# EAGLE design 2Wireless (EAGLE 7.4.0)
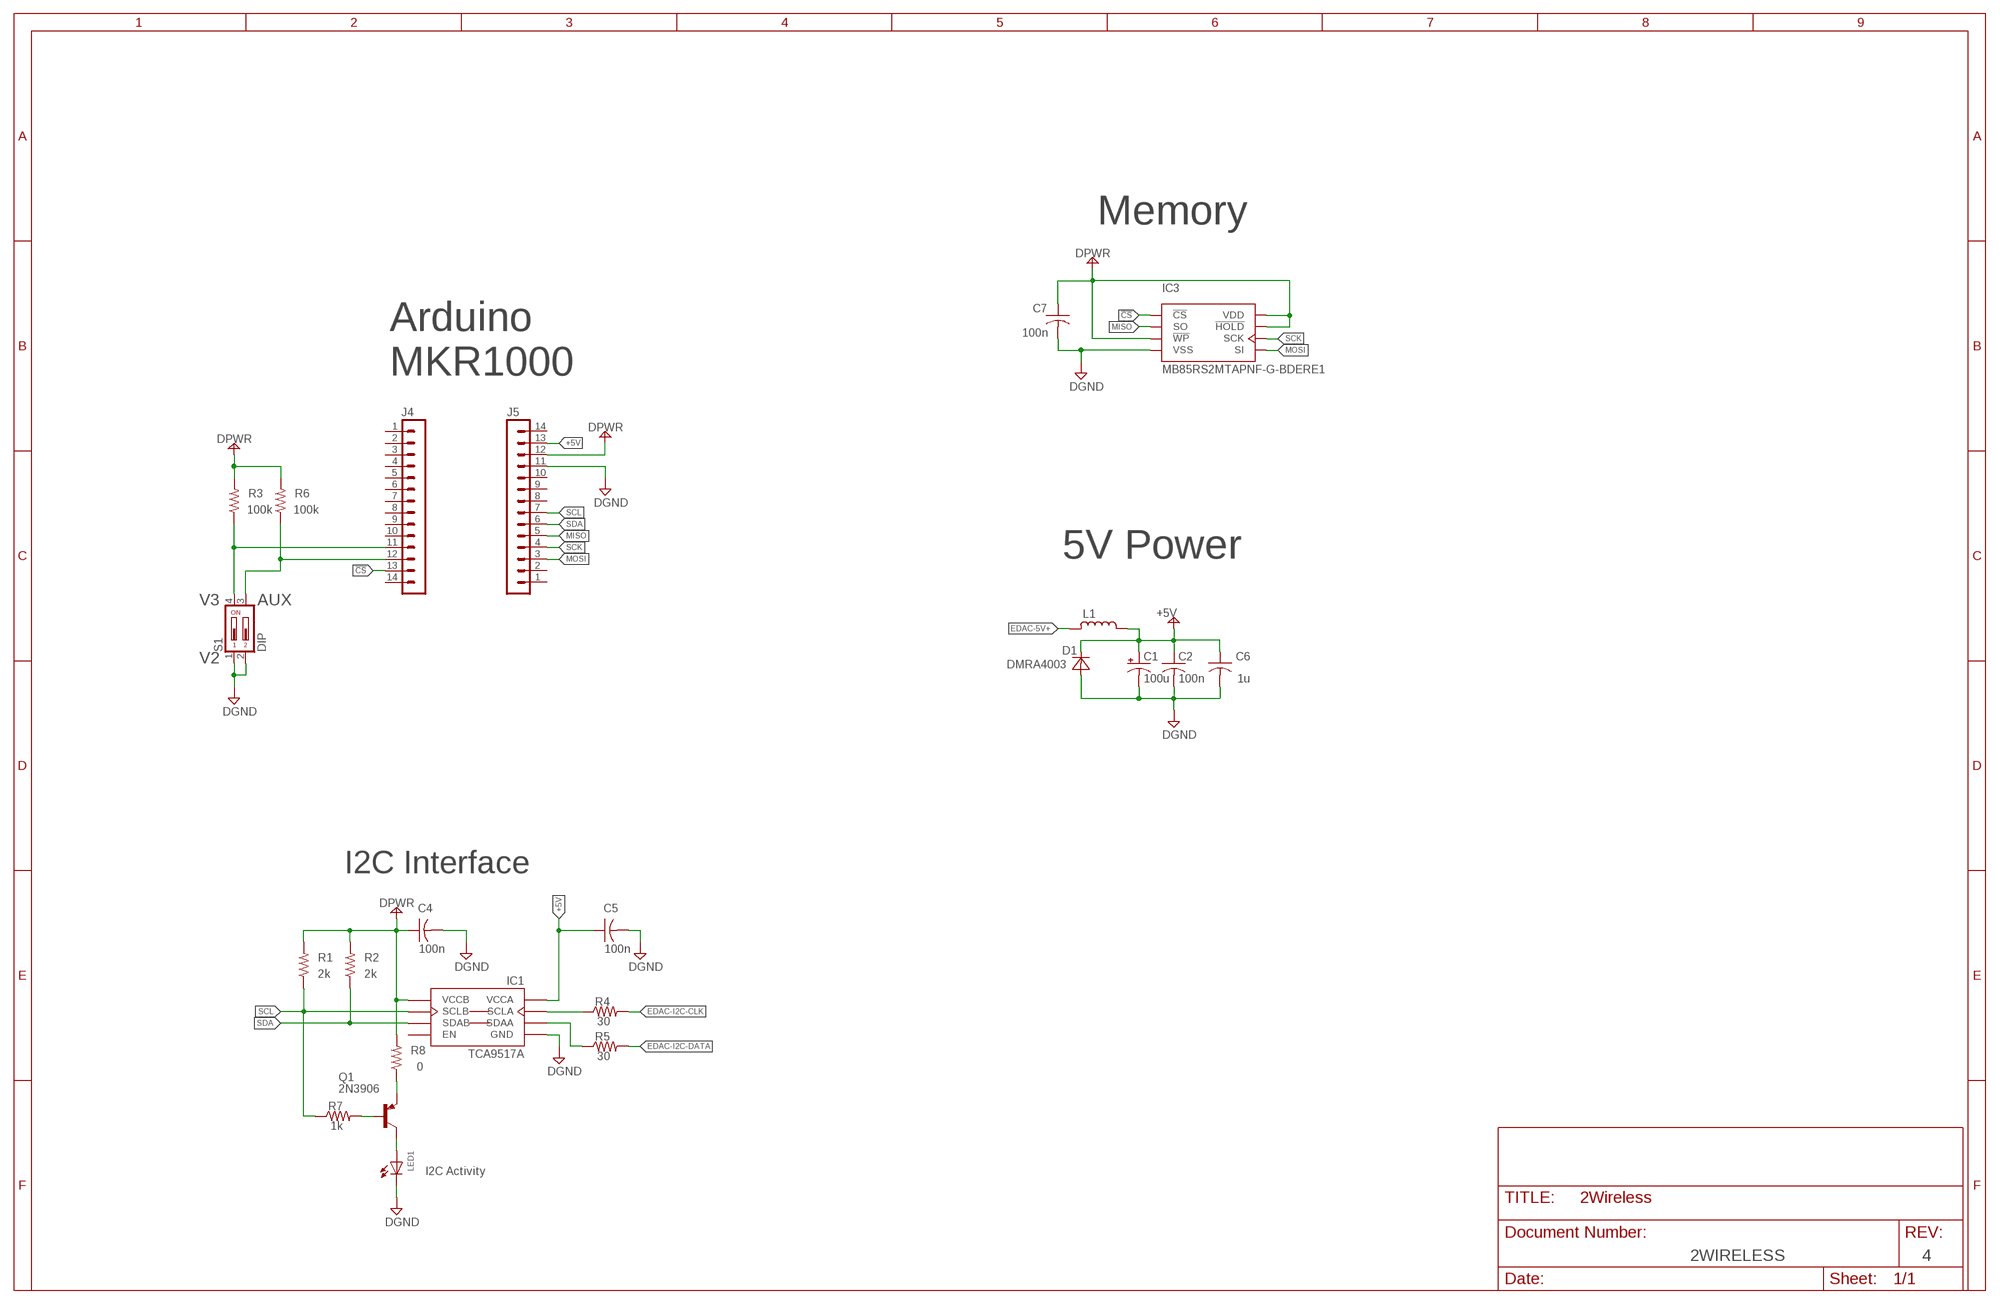
[diagram p0: schematic, sheet 1]

## Parts
C1  100u  C-POLPD  [PAN-D]
C2  100n  CB  [C0603]
C4  100n  CB  [C0603]
C5  100n  CB  [C0603]
C6  1u  CB  [C0603]
C7  100n  CB  [C0603]
D1  DMRA4003  [SMA]
IC1  TCA9517A  I2C-ISOLATORTCA9517A  [MSOP8]
IC3  MB85RS2MTAPNF-G-BDERE1  FRAMSPI  [SO08]
J4  MA14-1  [MA14-1]
J5  MA14-1  [MA14-1]
L1  LB  [0603]
LED1  LED0805BLUE  [CHIPLED_0805]
Q1  2N3906  PNPMMBT3906  [SOT23]
R1  2k  RB  [R0603]
R2  2k  RB  [R0603]
R3  100k  RB  [R0603]
R4  30  RB  [R0603]
R5  30  RB  [R0603]
R6  100k  RB  [R0603]
R7  1k  RB  [R0603]
R8  0  RB  [R0603]
S1  DIP  219-02  [CTS-219-02]

## Nets
!CS: IC3.1(!CS) J4.13
+5V [Power]: C1.+ C2.1 C5.1 C6.1 D1.K(C) IC1.1(VCCA) J5.13 L1.2
DGND: C1.- C2.2 C4.2 C5.2 C6.2 C7.2 D1.A IC1.4(GND) IC3.4(VSS) J5.11 LED1.C S1.1 S1.2
DI-AUX: J4.12 R6.1 S1.3
DI-VERSION: J4.11 R3.1 S1.4
DPWR: C4.1 C7.1 IC1.8(VCCB) IC3.3(!WP) IC3.7(!HOLD) IC3.8(VDD) J5.12 R1.2 R2.2 R3.2 R6.2 R8.2
EDAC-5V+: L1.1
EDAC-I2C-CLK: R4.2
EDAC-I2C-DATA: R5.2
MISO: IC3.2(SO) J5.5
MOSI: IC3.5(SI) J5.3
N$1: Q1.1(B) R7.2
N$2: LED1.A Q1.2(C)
N$3: Q1.3(E) R8.1
N$137: IC1.2(SCLA) R4.1
N$138: IC1.3(SDAA) R5.1
SCK: IC3.6(SCK) J5.4
SCL: IC1.7(SCLB) J5.7 R1.1 R7.1
SDA: IC1.6(SDAB) J5.6 R2.1
Unconnected: IC1.5(EN) J4.1 J4.2 J4.3 J4.4 J4.5 J4.6 J4.7 J4.8 J4.9 J4.10 J4.14 J5.1 J5.2 J5.8 J5.9 J5.10 J5.14

## Notes on the sheet
- Memory
- Arduino
  MKR1000
- 5V Power
- V3 | AUX
- V2
- I2C Interface
- I2C Activity
- 2WIRELESS | 4

## Library data of the parts
C1 = studio_h:C-POL: Polarized Capacitor; MF: PANASONIC; MPN: EEE-1CA101WP; Z_DIGIKEY: PCE3880CT-ND; Z_MOUSER: 667-EEE-1CA101WP; Z_SMT: Y
C2 C4-C7 = studio_h:C: Non-Polarized Capacitor; Z_SMT: Y
D1 = studio_h:D: Diode; MF: ON; MPN: MRA4003T3G; Z_DIGIKEY: MRA4003T3GOSCT-ND; Z_MOUSER: 863-MRA4003T3G; Z_SMT: Y
IC1 = studio_h:I2C-ISOLATOR: I2C ISOLATOR Technical Specifications: 2-Bit Bidirectional Isolator for Lines in Mixed-Mode I2C Applications No internal pullups Input glitch filtering Output slope control Shared ground Source: Data Sheet <http://www.ti.com/lit/ds/symlink/tca9517a.pdf>; MF: TI; MPN: TCA9517ADGKR; Z_DIGIKEY: 296-39220-1-ND; Z_MOUSER: 595-TCA9517ADGKR; Z_SMT: Y
IC3 = studio_h:FRAMSPI: FRAM 8SOP Technical Specifications: FRAM Memory SPI Interface Source: Data Sheet <https://www.fujitsu.com/uk/Images/MB85RS2MTA.pdf>; MF: FUJITSU; MPN: MB85RS2MTAPNF-G-BDERE1; Z_DIGIKEY: 865-1286-1-ND; Z_SMT: Y
J4 J5 = studio_h:MA14-1
L1 = studio_h:L: Inductor; MF: WURTH; MPN: 742792609; Z_DIGIKEY: 732-1591-1-ND; Z_MOUSER: 710-742792609; Z_SMT: Y
LED1 = studio_h:LED: LED
Q1 = studio_h:PNP: PNP Transistor; MF: FAIRCHILD; MPN: MMBT3906; Z_DIGIKEY: MMBT3906FSCT-ND; Z_MOUSER: 512-MMBT3906; Z_SMT: Y
R1-R8 = studio_h:R: Resistor; Z_SMT: Y
S1 = studio_h:219-02*: Surface Mount DIP Switch Series 219 SMT CTS Electronic Components Source: www.ctscorp.com; MF: CTS; MPN: 219-2MST; Z_DIGIKEY: CT2192MST-ND; Z_MOUSER: 774-2192MST; Z_SMT: Y

## Net classes
0 Signal: width 0.254 mm, clearance 0.205 mm
1 Power: width 0.508 mm, clearance 0.205 mm to class 0, clearance 0.205 mm
2 GND: width 0.889 mm

## Board
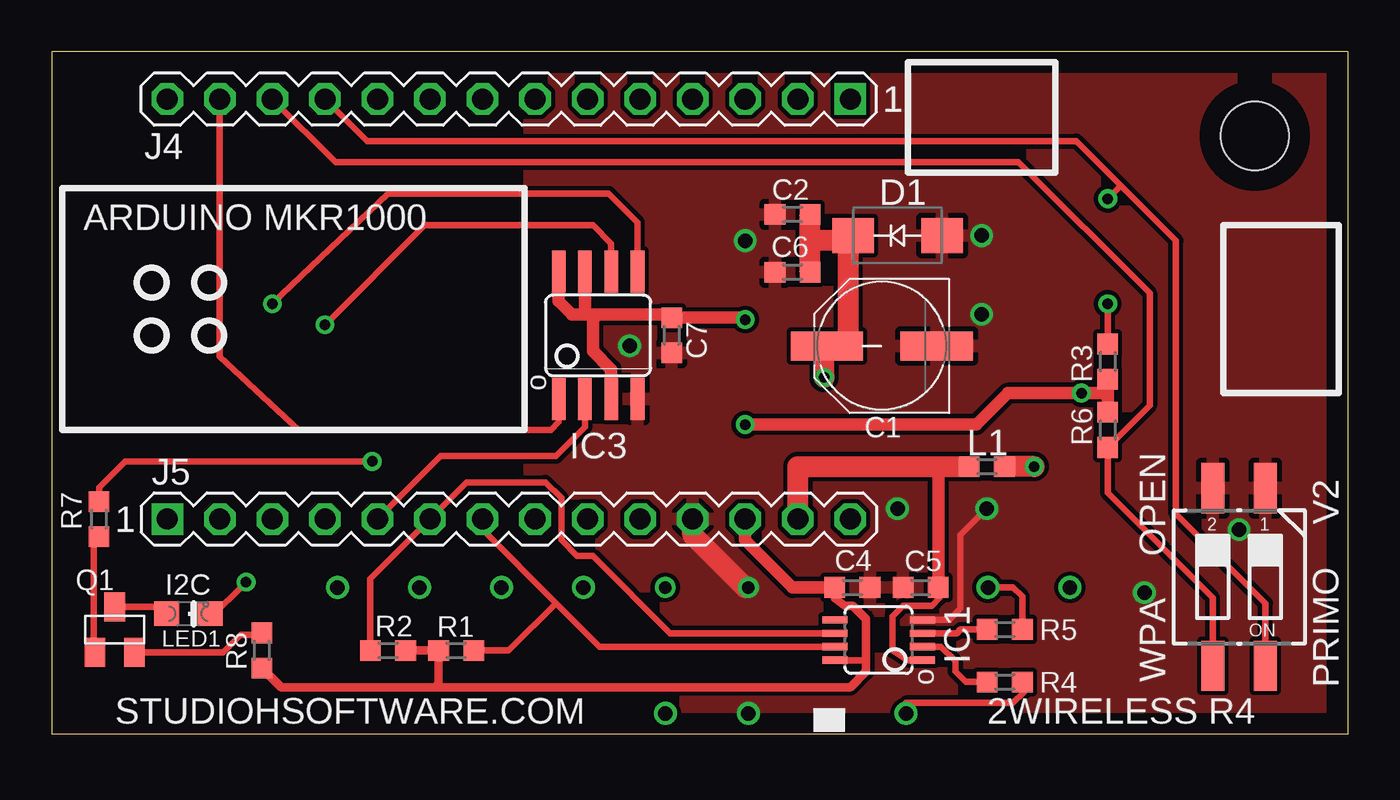
[diagram p1: board, top side]
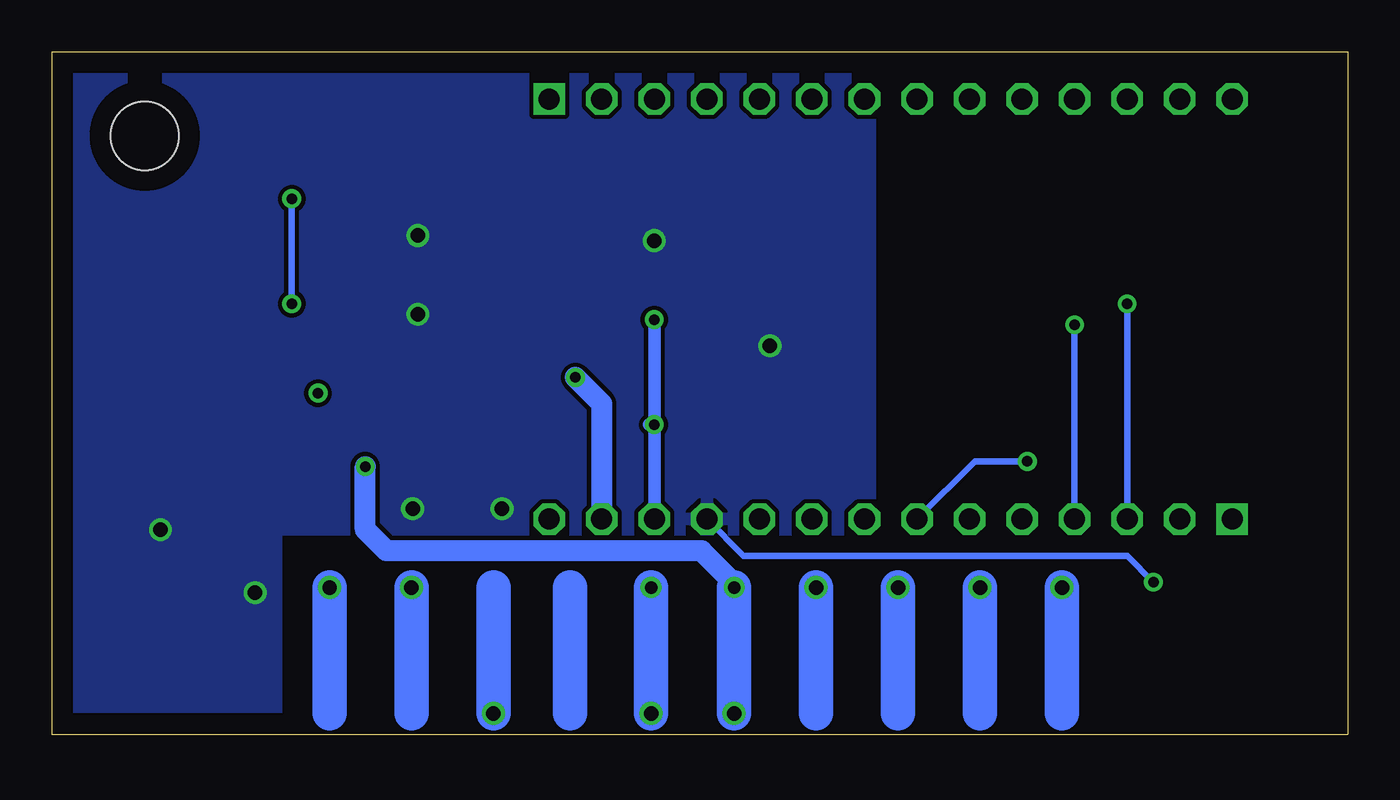
[diagram p2: board, bottom side, seen from below]

Size 62.66 x 33.02 mm. Coordinates in mm from the lower left corner, seen from the top.
Outline: 62.66,33.02 0,33.02 0,0 62.66,0 62.66,33.02
Copper layers (1*16): Top 0.035mm / dielectric 0.2mm / Bottom 0.035mm
Design rules "default *": minimum track width 10mil, minimum drill 20mil, track to track 8mil, track to pad 8mil, pad to pad 8mil, via to via 8mil, smd to smd 8mil, copper to edge 40mil, drill to drill 8mil, minimum pad ring 10mil, minimum via ring 8mil, stop-mask expansion 4mil, vias tented up to drill 0mil, thermal gap 10mil
Holes 3.3 mm at 58.17,28.96

### Footprints (pad centres in the part's own frame; a part is rotated, then mirrored left to right if it is on the bottom)
PAN-D = smd 3.5 x 1.4: + 2.65,0; - -2.65,0
C0603 = smd 1 x 1: 1 -0.85,0; 2 0.85,0
SMA = smd 2 x 1.7: A -2.15,0; K 2.15,0
MSOP8 = smd 0.35 x 1.2: 1 -0.976,-2.113; 2 -0.326,-2.113; 3 0.324,-2.113; 4 0.974,-2.113; 5 0.974,2.112; 6 0.324,2.112; 7 -0.326,2.112; 8 -0.976,2.112
SO08 = smd 0.66 x 2.032: 1 -1.905,-3.073; 2 -0.635,-3.073; 3 0.635,-3.073; 4 1.905,-3.073; 5 1.905,3.073; 6 0.635,3.073; 7 -0.635,3.073; 8 -1.905,3.073
MA14-1 = drill 1.016 square: 1 0,0 | drill 1.016 octagon: 2 2.54,0; 3 5.08,0; 4 7.62,0; 5 10.16,0; 6 12.7,0; 7 15.24,0; 8 17.78,0; 9 20.32,0; 10 22.86,0; 11 25.4,0; 12 27.94,0; 13 30.48,0; 14 33.02,0
0603 = smd 1 x 1: 1 -0.85,0; 2 0.85,0
CHIPLED_0805 = smd 1.2 x 1.2: A 0,-1.05; C 0,1.05
SOT23 = smd 1 x 1.4: 1 -0.95,-1.1; 2 0,1.1; 3 0.95,-1.1
R0603 = smd 1 x 1: 1 -0.85,0; 2 0.85,0
CTS-219-02 = smd 1.13 x 2.44: 1 -1.27,-4.3; 2 1.27,-4.3; 3 1.27,4.3; 4 -1.27,4.3

### Placement (x,y rotation side)
C1  40.13,18.8 180 top
C2  35.81,25.15 180 top
C4  38.71,7.11 0 top
C5  42.01,7.11 180 top
C6  35.81,22.35 180 top
C7  29.97,19.3 270 top
D1  40.89,24.13 180 top
IC1  39.98,4.57 90 top
IC3  26.42,19.3 0 top
J4  38.61,30.73 180 top
J5  5.59,10.41 0 top
L1  45.21,12.95 180 top
LED1  6.6,5.84 270 top
Q1  3.05,5.08 0 top
R1  19.56,4.06 180 top
R2  16.26,4.06 0 top
R3  51.05,18.03 270 top
R4  46.08,2.54 0 top
R5  46.08,5.08 0 top
R6  51.05,14.73 90 top
R7  2.29,10.41 270 top
R8  10.16,4.06 270 top
S1  57.4,7.62 180 top

### Tracks (layer width: path | path; a pad name or v marks a point on that pad's centre or on a via)
!CS
  Top 0.305: IC3.1 24.51,15.11 24.13,14.73 11.94,14.73 8.13,18.29 J4.13
+5V  (via drill 0.51)
  Top 0.305: IC1.1 41.36,3.6 40.64,4.06 40.64,5.71 41.15,6.22 42.55,6.22 42.93,6.6 42.93,7.05 C5.1
  Top 0.61: 38.49,19.19 38.35,19.05 C1.+ | C5.1 42.86,12.76 42.67,12.95
  Top 1.016: 38.49,23.88 38.49,19.19 | C6.1 36.66,23.88 | 36.66,23.88 C2.1 | 38.49,23.88 36.66,23.88 | 38.49,23.88 D1.K | v37.34,17.27 37.34,18.65 C1.+ | J5.13 36.07,12.95 42.67,12.95 L1.2
  Bottom 1.016: v37.34,17.27 36.07,16 J5.13
AGND  (via drill 0.7)
  Bottom 1.676: v13.82,7.11 13.82,1.02
DGND  (via drill 0.51, 0.6, 0.7)
  Top 0.305: 42.73,5.55 IC1.4 43.39,5.55 43.94,6.1 43.94,9.65 v45.21,10.92 | LED1.C 7.62,5.59 v9.4,7.37
  Top 1.016: v33.68,7.11 33.53,7.11 30.99,9.65 J5.11
  Bottom 0.305: v9.4,7.37 10.67,8.64 29.21,8.64 J5.11
  Bottom 1.016: v33.68,7.11 33.78,7.11
  Bottom 1.676: v33.68,1.02 v33.68,7.11
  other vias: 27.94,18.8 52.83,6.86 33.53,23.88 57.4,9.91 44.96,24.13 44.96,20.32 40.89,10.92
  pour Top: 23.11,33.02 23.11,0.25 62.74,0.25 62.74,33.02
  pour Bottom: 23.11,33.02 23.11,9.91 51.82,9.91 51.82,0.25 62.74,0.25 62.74,33.02
DI-AUX
  Top 0.305: J4.12 13.72,27.69 46.74,27.69 53.09,21.34 53.09,15.91 R6.1 51.05,11.68 56.13,6.6 S1.3
DI-VERSION  (via drill 0.51)
  Top 0.305: J4.11 15.24,28.7 49.53,28.7 51.69,26.54 | 51.69,26.54 54.36,23.88 54.36,10.67 58.67,6.35 S1.4 | R3.1 v51.05,20.83 | v51.05,25.91 51.69,26.54
  Bottom 0.305: v51.05,20.83 v51.05,25.91
DPWR  (via drill 0.51)
  Top 0.305: IC1.8 39.33,3.6 39.37,3.56 | 17.02,3.98 R2.2
  Top 0.406: C4.1 37.86,6.59 38.35,6.22 38.73,6.22 39.37,5.59 39.37,3.56 39.37,3.05 38.61,2.29 18.54,2.29 | 18.54,2.29 11.09,2.29 R8.2 | R2.2 R1.2 18.71,2.45 18.54,2.29
  Top 0.61: IC3.8 24.51,20.95 25.15,20.32 25.65,20.32 | 25.65,20.32 26.42,20.32 | 26.42,20.32 29.97,20.32 C7.1 33.44,20.15 v33.53,20.07 | IC3.7 25.78,20.45 25.65,20.32 | IC3.3 27.05,17.65 26.16,18.54 26.16,20.07 26.42,20.32 | R6.2 R3.2 51.05,16.51 v49.78,16.51 46.23,16.51 44.7,14.99 v33.53,14.99 | C4.1 35.81,7.11 33.53,9.4 J5.12
  Bottom 0.61: J5.12 33.53,14.73 | 33.53,14.73 v33.53,14.99 | v33.53,14.99 v33.53,20.07 | v33.53,14.99 33.78,14.99 33.53,14.73
EDAC-5V+  (via drill 0.51, 0.6, 0.7)
  Top 1.016: v47.5,12.95 L1.1
  Bottom 0.61: v29.67,1.02 29.67,1.47
  Bottom 1.016: v47.5,12.95 47.5,9.91 46.48,8.89 31.24,8.89 29.72,7.37 29.72,6.66 29.67,6.6
  Bottom 1.676: v29.67,7.11 29.67,6.6 v29.67,1.02
EDAC-12V+  (via drill 0.7)
  Bottom 1.676: v25.7,7.11 25.7,1.02
EDAC-15V+  (via drill 0.7)
  Bottom 1.676: v21.74,7.11 21.74,1.02
EDAC-15V-  (via drill 0.7)
  Bottom 1.676: v17.78,7.11 17.78,1.02
EDAC-I2C-CLK  (via drill 0.7)
  Top 0.305: R4.2 46.99,2.48 46.99,2.03 46.48,1.52 41.3,1.52 v41.3,1.02
  Bottom 1.676: 41.3,7.11 v41.3,1.02
EDAC-I2C-DATA  (via drill 0.7)
  Top 0.305: R5.2 46.93,6.67 46.48,7.11 v45.26,7.11
  Bottom 1.676: v45.26,7.11 45.26,1.02
MISO
  Top 0.305: J5.5 18.8,13.46 24.38,13.46 25.78,14.86 IC3.2
MOSI  (via drill 0.51)
  Top 0.305: IC3.5 28.32,24.77 26.92,26.16 16.26,26.16 v10.67,20.83
  Bottom 0.305: v10.67,20.83 J5.3
N$1
  Top 0.305: Q1.1 2.03,4.05 2.03,9.31 R7.2
N$2
  Top 0.305: Q1.2 5.01,6.18 LED1.A
N$3
  Top 0.305: Q1.3 8.3,3.98 9.14,4.83 10.07,4.83 R8.1
N$5
  Bottom 1.676: 37.59,7.11 37.59,1.02
N$137
  Top 0.305: IC1.2 43,4.25 43.69,3.56 43.69,3.05 44.2,2.54 R4.1
N$138
  Top 0.305: IC1.3 43.76,4.9 43.94,5.08 R5.1
NC  (via drill 0.7)
  Bottom 1.676: v49.23,7.11 49.23,1.02
SCK  (via drill 0.51)
  Top 0.305: IC3.6 27.05,23.75 26.16,24.64 18.03,24.64 v13.21,19.81
  Bottom 0.305: v13.21,19.81 J5.4
SCL  (via drill 0.51)
  Top 0.305: IC1.7 26.49,4.25 24.38,6.35 | 24.38,6.35 20.83,9.91 J5.7 | R1.1 22.1,4.06 24.38,6.35 | R7.1 2.29,11.94 3.56,13.21 v15.49,13.21
  Bottom 0.305: v15.49,13.21 18.03,13.21 J5.7
SDA
  Top 0.305: IC1.6 29.9,4.9 26.16,8.64 25.4,8.64 24.64,9.4 24.64,11.43 23.88,12.19 20.07,12.19 J5.6 15.41,7.53 R2.1

### Text on the board
tPlace: o | o
tNames: ARDUINO MKR1000 | V2 | OPEN | I2C | WPA | PRIMO | STUDIOHSOFTWARE.COM | 2WIRELESS R4